# Altium project IR_Sensor.PrjPcb
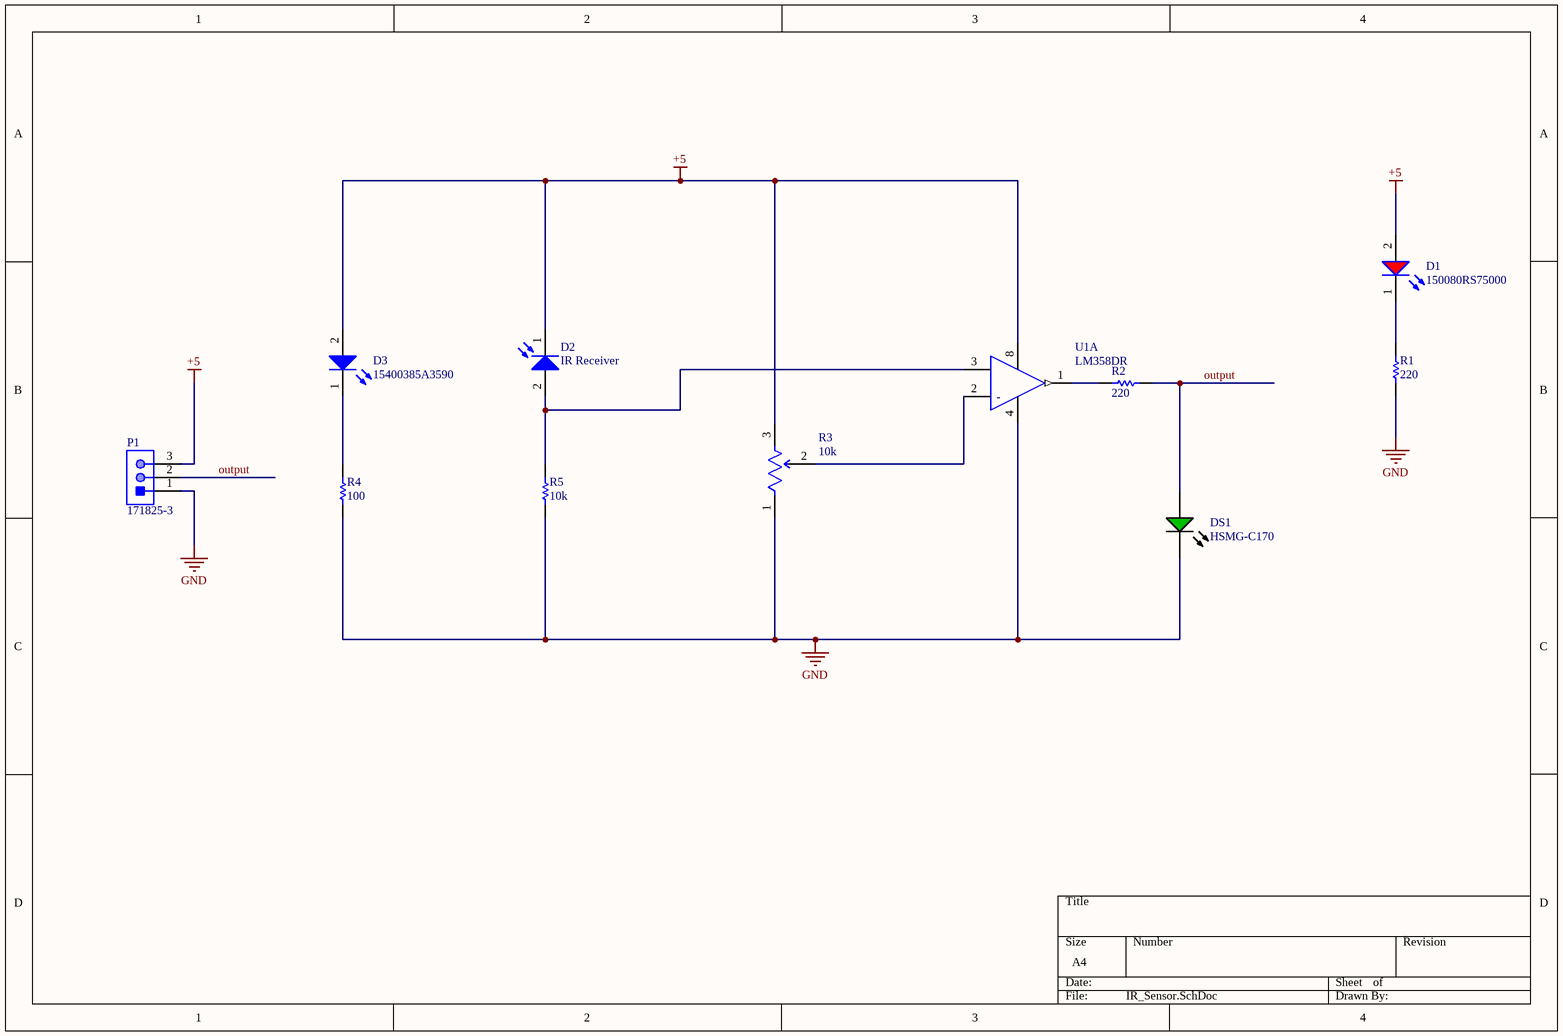
[diagram p0: IR_Sensor.SchDoc]
1 sheet, 11 parts. Net scope: global (net labels, ports and power ports of the same name join across sheets).
Board file: IR_Sensor_PCB.PcbDoc

## Sheet IR_Sensor.SchDoc
size A4; SheetNumber: 1; SheetTotal: 1

### Parts
D1  150080RS75000  [WL-SMCW_0805_150080xx75000]
D2  IR Receiver  [IR_Receiver]
D3  15400385A3590  [WL-TIRW_D3.9H5.3]
DS1  HSMG-C170  [AVAG-HSMX-C170_V]
P1  171825-3  [TECO-171825-3_V]
R1  220  [RESC2013X65X40LL15T20]
R2  220  [RESC2013X65X40LL15T20]
R3  10k  [FP-3361P-MFG]
R4  100  [RESC2013X65X40LL15T20]
R5  10k  [RESC2013X65X40LL15T20]
U1  LM358DR  [FP-D0008A-MFG]  (part A of 2)

### Nets
+5: D1.2(A) D2.1(K) D3.2(A) P1.3 R3.3(CW) U1.8(V+)
GND: DS1.2(K) P1.1 R1.1 R3.1(CCW) R4.1 R5.1 U1.4(V-)
output: DS1.1(A) P1.2 R2.1
NetD1_1: D1.1(K) R1.2
NetD2_2: D2.2(A) R5.2 U1.3(IN1+)
NetD3_1: D3.1(K) R4.2
NetR2_2: R2.2 U1.1(1OUT)
NetR3_2: R3.2(WIPER) U1.2(IN1-)

### Notes on the sheet
- (in symbol CMP-1685-00009-2, part A) -

### Library data of the parts
D1 = CMP-1426-00011-3: LED Uni-Color Red 630nm 2-Pin Chip 0805(2012Metric) T/R; Viewing Angle: 140°; Max Junction Temperature (Tj): 95°C; Power Dissipation: 72mW; Forward Current: 100mA; Forward Voltage: 2V; Wavelength: 625nm; Test Current: 20mA; Max Reverse Voltage (DC): 5V; Luminous Intensity: 150mcd; Lens Style: Clear, Rectangular; REACH SVHC: Unknown; Height: 700µm; Case Code (Metric): 2012; Peak Wavelength: 630nm; Length: 2mm; Width: 1.25mm; RoHS: Compliant; Packaging: Tape and Reel; Dominant Wavelength: 625nm; Color: Red; Case Code (Imperial): 0805; Min Operating Temperature: -40°C; Mount: Surface Mount; Max Operating Temperature: 85°C; Case/Package: 0805
D2 = IR_Receiver
D3 = CMP-03913-82270983-1: 15400385A3590 WL-TIRW THT Infrared Round Waterclear; Forward Voltage: 1.5V; Viewing Angle: 35°; Wavelength: 850nm; Max Reverse Voltage (DC): 5V; Forward Current: 1A; Packaging: Bulk; RoHS: Non-Compliant; Peak Wavelength: 850nm; NexarPartId: 82270983
DS1 = CMP-2000-05062-1: Chip LED, Green, 2.2 V, -40 to 85 degC, 2-Pin SMD, Pb-Free, Tape and Reel; Manufacturer: Avago; No. of Pins: 2; Peak Wavelength: 570nm; SVHC: NoSVHC(16-Jun-2014); Dominant Wavelength: 572nm; Forward Current If: 20mA; Viewing Angle: 170deg; Lens Shape: Rectangular; PIV Max: 5V; External Width: 1.25mm; LED Type: Standard; External Depth: 0.8mm; Opto Mounting Orientation: Top; Luminous Intensity: 15mcd; Luminous Intensity Min: 4mcd; Forward Voltage VF Max: 2.6V; External Length / Height: 2mm; Bulb Size: 1.25mmx1.4mm; Light Area Height: 1mm; Voltage Vf Typ: 2.2V; Operating Temperature Max: 85degC; Datasheet Version: Oct-08; MSL: MSL2A-4weeks; Peak Forward Current: 20mA; Package Description: 2-Pin Surface Mount Device, Body 2 x 1.25 mm, Height 0.8 mm; Datasheet URL: https://datasheet.ciiva.com/29280/180495-da-01-en-chip-led-hsmg-c170-gelb-gruen-29280971.pdf; Storage Temperature Min: -40degC; LED Colour: Green; Wavelength Typ: 570nm; Mounting Type: SMD; Forward Current If Max: 20mA; Dominant Wavelength Typ: 572nm; LED Mounting: SMD; Operating Temperature Range: -30degCto+85degC; Operating Temperature Min: -30degC; Manufacturer URL: http://www.avagotech.com/; Packaging: CutTape; Luminous Intensity Typ: 15mcd; Package Reference: HSMX-C170; Storage Temperature Max: 85degC; Opto Case Style: SMD; Forward Voltage: 2.2V
P1 = CMP-2000-07494-1: Male Header, Pitch 2.5 mm, 1 x 3 Position, Height 10.4 mm, Tail Length 3.6 mm, / -20 to 95 degC / , RoHS, Bulk; Manufacturer: TE Connectivity; Mating Alignment: Yes(With); Tail Length: 0.142inch; Mating Post Length: 7.5mm; PCB Thickness: 0.063inch; PCB Mount Alignment: No(Without); Voltage Rating: 350V; Max Voltage Rating (AC): 250V; Plating Thickness: 0.8um; PCB Mounting Orientation: Vertical; Number of Positions: 3; PCB Mount Retention: Without; Max Current Rating: 3.5A; Max Voltage Rating (DC): 350.25kV; Pitch: 2.5mm; Approvals: UL; Contact Resistance: 20mOhm; Mount: ThroughHole; Length: 7.5mm; Orientation: Straight; Contact Mating Length: 0.295inch; Contact Material: Brass; Housing Material: Nylon; Package Description: Male Header, Pitch 2.5 mm, 1 x 3 Position, Height 10.4 mm, Tail Length 3.6 mm; Colour: Natural; Backwall/Post Interruptions: No(Without); Min Operating Temperature: -20degC; Mating Retention: Yes(With); Connector Type: Header; Packaging: Bag; RoHSCompliant: True; Package Reference: 171825-3; Contact Shape: Square; Strain Relief: No(Without); Contact Gender: Male; Number of Contacts: 3; Manufacturer URL: http://www.te.com/; Height: 0.409inch; Contact Retention: No(Without); Datasheet Version: Rev. Y3, 12/2016; Panel Mount Retention: No(Without); Datasheet URL: http://www.te.com/commerce/DocumentDelivery/DDEController?Action=showdoc&DocId=Customer+Drawing%7F171825%7FY3%7Fpdf%7FEnglish%7FENG_CD_171825_Y3.pdf%7F171825-3; Termination: Solder; Mounting Technology: ThroughHole; Max Operating Temperature: 95degC; Flammability Rating: UL94V-0; REACH SVHC: NoSVHC; Housing Colour: Natural; Package Quantity: 1000; Number of Rows: 1; Depth: 4.9mm; Contact Plating: Tin
R1 R2 R4 R5 = CMP-2000-07514-1: Chip Resistor, 0 Ohm, 0.125 W, -55 to 125 degC, 0805 (2012 Metric), RoHS, Tape and Reel; Manufacturer: TE Connectivity; Power Rating: 125mW; Voltage Rating: 150V; Tolerance: 0%; Case\/Package: 0805; Number of Resistors: 1; Resistance: 0mOhm; Datasheet URL: www.te.com/commerce/DocumentDelivery/DDEController?Action=showdoc&DocId=Customer+Drawing%7F1623401%7FBA%7Fpdf%7FEnglish%7FENG_CD_1623401_BA.pdf%7F1623401-1; Composition: ThickFilm; Max Operating Temperature: 125degC; Min Operating Temperature: -55degC; ELV: Compliant; Case Code (Metric): 2012; Number of Terminations: 2; Weight: 0.000194oz; Length: 2mm; Mount: SurfaceMount; Packaging: TapeandReel; Case Code (Imperial): 0805; RoHSCompliant: true; Width: 1.25mm; Radiation Hardening: No; Termination: Solder; Manufacturer URL: http://www.te.com/; Package Description: 2-Pin Surface Mount Device, Body 2 x 1.25 mm; Mounting Technology: SurfaceMount; Height: 0.55mm; Package Quantity: 5000; Package Reference: RESC2013X65X40L15T20; Datasheet Version: Rev. BA, 12/2009; Depth: 1.25mm
R3 = CMP-07234-000005-1: TRIMMER 5K OHM 0.5W GW TOP ADJ; Manufacturer: Bourns; Manufacturer Part Number: 3361P-1-502GLF; Temperature Coefficient: 100ppm/°C; Description: 5 kOhms 0.5W, 1/2W Gull Wing Surface Mount Trimmer Potentiometer Cermet 1 Turn Top Adjustment; Tolerance: 10%; Resistance: 5kΩ; Value: 5kΩ; Voltage Rating: 300V; Lead Free: Yes; Power Rating: 0.5W; Automotive: No; Temperature Range Low: -55°C; ComponentLink2URL: https://www.bourns.com/docs/product-datasheets/3361.pdf?sfvrsn=3426000b_8; Device Class L2: Resistors; Series: 3361; Octopart: https://octopart.com/3361p-1-502glf-bourns-92301; Temperature Range High: +125°C; Composition: Cermet; Height: 5.84mm; RoHS: TRUE; Device Class L1: Passive Components; Mouser Description: Trimmer Resistors - SMD 1/4" SQ 5K 10% 0.5WATTS; Package: 3361P; Category: Res; ComponentLink2Description: Datasheet; Digikey Description: TRIMMER 5K OHM 0.5W GW TOP ADJ; Device Class L3: Variable Resistors and Potentiometers; Temperature: -55°C to +125°C
U1 = CMP-1685-00009-2: IC OPAMP GP 2 CIRCUIT 8SOIC; Output Current: 30mA; Min Dual Supply Voltage: 1.5V; Input Offset Voltage (Vos): 7mV; Power Supply Rejection Ratio (PSRR): 65dB; Unity Gain Bandwidth Product: 700kHz; Number of Channels: 2; Min Supply Voltage: 3V; Max Dual Supply Voltage: 16V; Dual Supply Voltage: 9V; Max Supply Voltage: 32V; Nominal Supply Current: 1.2mA; Slew Rate: 0.3V/µs; Input Bias Current: 250nA; Voltage Gain: 100dB; Operating Supply Current: 1mA; REACH SVHC: No SVHC; Package Quantity: 2500; Width: 3.91mm; Max Operating Temperature: 70°C; Min Operating Temperature: 0°C; Mount: Surface Mount; Length: 4.9mm; Radiation Hardening: No; Case/Package: SOIC; Lead Free: Lead Free; Number of Elements: 2; Packaging: Tape and Reel; Output Current per Channel: 30mA; Number of Circuits: 2; Bandwidth: 700kHz; Operating Supply Voltage: 16V; Gain Bandwidth Product: 700kHz; Number of Pins: 8; Number of Amplifiers: 2; Height: 1.58mm; Common Mode Rejection Ratio: 65dB; Contact Plating: Gold